# Altium schematic sheet Logic.SchDoc
size C; SheetNumber: 1; SheetTotal: 1
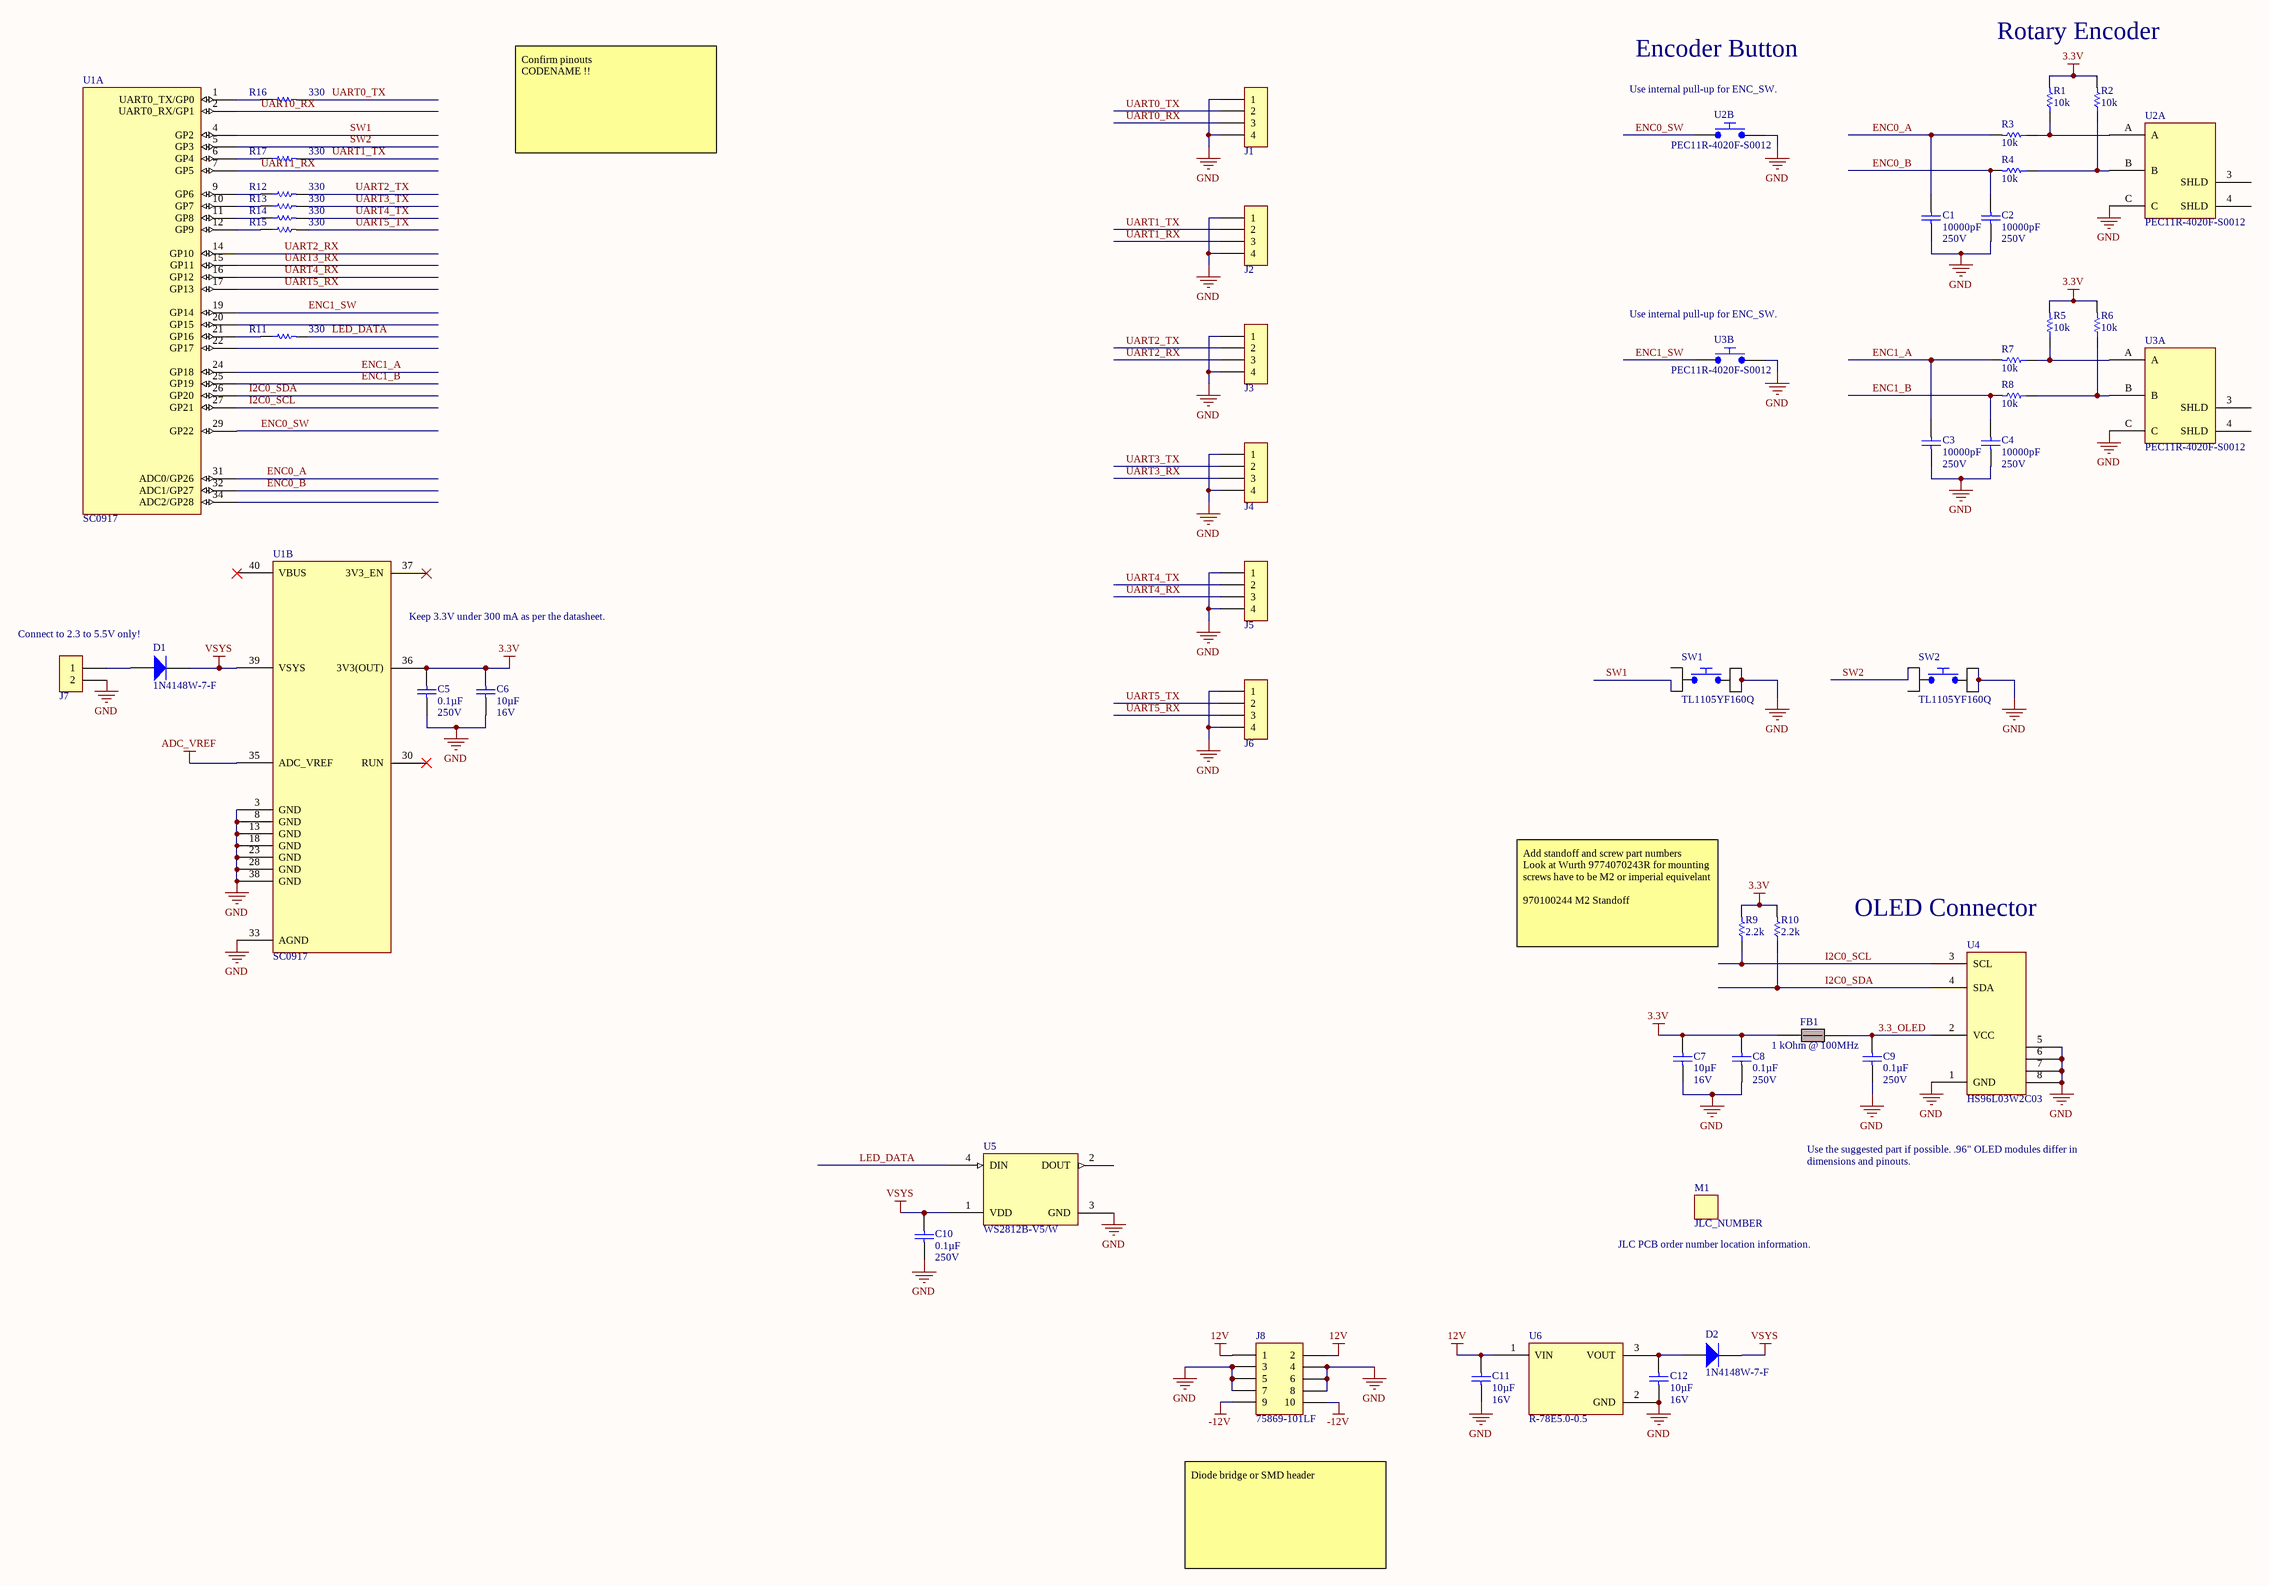
[diagram p0: Logic.SchDoc]

## Parts
C1  10000pF  Voltage: 250V  [Chip0805]
C2  10000pF  Voltage: 250V  [Chip0805]
C3  10000pF  Voltage: 250V  [Chip0805]
C4  10000pF  Voltage: 250V  [Chip0805]
C5  0.1µF  Voltage: 250V  [Chip0805]
C6  10µF  Voltage: 16V  [Chip0805]
C7  10µF  Voltage: 16V  [Chip0805]
C8  0.1µF  Voltage: 250V  [Chip0805]
C9  0.1µF  Voltage: 250V  [Chip0805]
C10  0.1µF  Voltage: 250V  [Chip0805]
C11  10µF  Voltage: 16V  [Chip0805]
C12  10µF  Voltage: 16V  [Chip0805]
D1  1N4148W-7-F  [SOD-123]
D2  1N4148W-7-F  [SOD-123]
FB1  Impedance @ Frequency: 1 kOhm @ 100MHz  [Chip0805]  (hidden comment: FERRITE)
J1  0533980471  [Molex_0533980471]  (value not drawn)
J2  0533980471  [Molex_0533980471]  (value not drawn)
J3  0533980471  [Molex_0533980471]  (value not drawn)
J4  0533980471  [Molex_0533980471]  (value not drawn)
J5  0533980471  [Molex_0533980471]  (value not drawn)
J6  0533980471  [Molex_0533980471]  (value not drawn)
J7  3-644456-2  [TE_3-644456-2]  (value not drawn)
J8  75869-101LF  [IDC_100_2x5]
M1  JLC_NUMBER  [JLC_NUMBER]  (no BOM)
R1  10k  [Chip0805]
R2  10k  [Chip0805]
R3  10k  [Chip0805]
R4  10k  [Chip0805]
R5  10k  [Chip0805]
R6  10k  [Chip0805]
R7  10k  [Chip0805]
R8  10k  [Chip0805]
R9  2.2k  [Chip0805]
R10  2.2k  [Chip0805]
R11  330  [Chip0805]
R12  330  [Chip0805]
R13  330  [Chip0805]
R14  330  [Chip0805]
R15  330  [Chip0805]
R16  330  [Chip0805]
R17  330  [Chip0805]
SW1  TL1105YF160Q  [E-Switch_TL1105YF]
SW2  TL1105YF160Q  [E-Switch_TL1105YF]
U1  SC0917  [RASPBERRY_PI_PICO_H]  (parts A,B of 2)
U2  PEC11R-4020F-S0012  [BOURNS_PEC11R-4020F-S]  (parts A,B of 2)
U3  PEC11R-4020F-S0012  [BOURNS_PEC11R-4020F-S]  (parts A,B of 2)
U4  HS96L03W2C03  [HS_HS96L03W2C03]
U5  WS2812B-V5/W  [WS2812B]
U6  R-78E5.0-0.5  [3-SIP_Module]

## Nets
3.3V: C5.2 C6.2 C7.2 C8.2 FB1.1 R1.2 R2.2 R5.2 R6.2 R9.2 R10.2 U1.36(3V3(OUT))
12V: C11.2 J8.1 J8.2 U6.1(VIN)
-12V: J8.9 J8.10
ADC_VREF: U1.35(ADC_VREF)
GND: C1.1 C2.1 C3.1 C4.1 C5.1 C6.1 C7.1 C8.1 C9.1 C10.1 C11.1 C12.1 J1.1 J1.4 J2.1 J2.4 J3.1 J3.4 J4.1 J4.4 J5.1 J5.4 J6.1 J6.4 J7.2 J8.3 J8.4 J8.5 J8.6 J8.7 J8.8 SW1.3 SW1.4 SW2.3 SW2.4 U1.3(GND) U1.8(GND) U1.13(GND) U1.18(GND) U1.23(GND) U1.28(GND) U1.33(AGND) U1.38(GND) U2.1 U2.C U3.1 U3.C U4.1(GND) U4.5 U4.6 U4.7 U4.8 U5.3(GND) U6.2(GND)
VSYS: C10.2 D1.1(C) D2.1(C) U1.39(VSYS) U5.1(VDD)
3.3_OLED: C9.2 FB1.2 U4.2(VCC)
ENC0_A: C1.2 R3.2 U1.31(ADC0/GP26)
ENC0_B: C2.2 R4.2 U1.32(ADC1/GP27)
ENC0_SW: U1.29(GP22) U2.2
ENC1_A: C3.2 R7.2 U1.24(GP18)
ENC1_B: C4.2 R8.2 U1.25(GP19)
ENC1_SW: U1.19(GP14) U3.2
I2C0_SCL: R9.1 U1.27(GP21) U4.3(SCL)
I2C0_SDA: R10.1 U1.26(GP20) U4.4(SDA)
LED_DATA: R11.2 U5.4(DIN)
SW1: SW1.2 U1.4(GP2)
SW2: SW2.1 U1.5(GP3)
UART0_RX: J1.3 U1.2(UART0_RX/GP1)
UART0_TX: J1.2 R16.2
UART1_RX: J2.3 U1.7(GP5)
UART1_TX: J2.2 R17.2
UART2_RX: J3.3 U1.14(GP10)
UART2_TX: J3.2 R12.2
UART3_RX: J4.3 U1.15(GP11)
UART3_TX: J4.2 R13.2
UART4_RX: J5.3 U1.16(GP12)
UART4_TX: J5.2 R14.2
UART5_RX: J6.3 U1.17(GP13)
UART5_TX: J6.2 R15.2
NetC12_2: C12.2 D2.2(A) U6.3(VOUT)
NetD1_2: D1.2(A) J7.1
NetR1_1: R1.1 R3.1 U2.A
NetR2_1: R2.1 R4.1 U2.B
NetR5_1: R5.1 R7.1 U3.A
NetR6_1: R6.1 R8.1 U3.B
NetR11_1: R11.1 U1.21(GP16)
NetR12_1: R12.1 U1.9(GP6)
NetR13_1: R13.1 U1.10(GP7)
NetR14_1: R14.1 U1.11(GP8)
NetR15_1: R15.1 U1.12(GP9)
NetR16_1: R16.1 U1.1(UART0_TX/GP0)
NetR17_1: R17.1 U1.6(GP4)

Not connected (* = marked no-connect by the designer): SW1 1; SW2 2; U1 20(GP15) 22(GP17) 30(RUN)* 34(ADC2/GP28) 37(3V3_EN)* 40(VBUS)*; U2 3(SHLD) 4(SHLD); U3 3(SHLD) 4(SHLD); U5 2(DOUT)

## Notes on the sheet
- Encoder Button
- Rotary Encoder
- (near U2) Use internal pull-up for ENC_SW.
- Confirm pinouts
  CODENAME !!
- (near U3) Use internal pull-up for ENC_SW.
- Connect to 2.3 to 5.5V only!
- (near U1) Keep 3.3V under 300 mA as per the datasheet.
- (near R9) Add standoff and screw part numbers
  Look at Wurth 9774070243R for mounting
  screws have to be M2 or imperial equivelant
  970100244 M2 Standoff
- (near U4) OLED Connector
- Use the suggested part if possible. .96" OLED modules differ in dimensions and pinouts.
- (near M1) JLC PCB order number location information.
- Diode bridge or SMD header
- Title:
- This work is licensed under a Creative Commons Attribution 4.0 International License. Derivative works should remove all Sophistry branding and ‘é’ watermark.
- Date:
- Engineer:
- Revision:
- Codename:
- Time:
- Variant:
- Sheet
- of

## Library data of the parts
C1-C4 = C2012X7R2E103M125AE: CAP CER 10000PF 250V X7R 0805; Manufacturer: TDK Corporation; Tolerance: ±20%; PartNumber: C2012X7R2E103M125AE; HelpURL: http://product.tdk.com/capacitor/mlcc/en/documents/mlcc_commercial_soft_en.pdf; Supplier 1: Digi-Key; Supplier Part Number 1: 445-6805-1-ND; Supplier 2: Mouser; Manufacturer Part Number: C2012X7R2E103M125AE; Series: C; Capacitance: 10000pF; Temperature Coefficient: X7R; Mounting Type: Surface Mount, MLCC; Operating Temperature: -55°C ~ 125°C; Applications: Boardflex Sensitive; Ratings: -; Package / Case: 0805 (2012 Metric); Size / Dimension: 0.079" L x 0.049" W (2.00mm x 1.25mm); Height - Seated (Max): -; Thickness (Max): 0.057" (1.45mm); Lead Spacing: -; Features: Soft Termination; Lead Style: -
C5 C8-C10 = C2012X7T2E104K125AA: CAP CER 0.1UF 250V 10% X7T 0805; Manufacturer: TDK Corporation; PartNumber: C2012X7T2E104K125AA; HelpURL: http://product.tdk.com/capacitor/mlcc/en/documents/mlcc_commercial_midvoltage_en.pdf; Supplier 1: Digi-Key; Supplier Part Number 1: 445-7749-1-ND; Supplier 2: Mouser; Manufacturer Part Number: C2012X7T2E104K125AA; Series: C; Capacitance: 0.1µF; Tolerance: ±10%; Temperature Coefficient: X7T; Mounting Type: Surface Mount, MLCC; Operating Temperature: -55°C ~ 125°C; Applications: General Purpose; Ratings: -; Package / Case: 0805 (2012 Metric); Size / Dimension: 0.079" L x 0.049" W (2.00mm x 1.25mm); Height - Seated (Max): -; Thickness (Max): 0.057" (1.45mm); Lead Spacing: -; Features: -; Lead Style: -
C6 C7 C11 C12 = C2012X5R1C106K125AC: CAP CER 10UF 16V 10% X5R 0805; Manufacturer: TDK Corporation; PartNumber: C2012X5R1C106K125AC; HelpURL: http://product.tdk.com/capacitor/mlcc/en/documents/mlcc_commercial_general_en.pdf; Supplier 1: Digi-Key; Supplier Part Number 1: 445-7646-1-ND; Supplier 2: Mouser; Manufacturer Part Number: C2012X5R1C106K125AC; Series: C; Capacitance: 10µF; Tolerance: ±10%; Temperature Coefficient: X5R; Mounting Type: Surface Mount, MLCC; Operating Temperature: -55°C ~ 85°C; Applications: General Purpose; Ratings: -; Package / Case: 0805 (2012 Metric); Size / Dimension: 0.079" L x 0.049" W (2.00mm x 1.25mm); Height - Seated (Max): -; Thickness (Max): 0.057" (1.45mm); Lead Spacing: -; Features: -; Lead Style: -
D1 D2 = 1N4148W-7-F: DIODE SWITCH 100V 0.15A SOD123; Manufacturer: Diodes Incorporated; Diode Type: Standard; Current - Average Rectified (Io): 150mA; Voltage - Forward (Vf) (Max) @ If: 1.25V @ 150mA; Speed: Small Signal =< 200mA (Io), Any Speed; Reverse Recovery Time (trr): 4ns; Current - Reverse Leakage @ Vr: 1µA @ 75V; Capacitance @ Vr, F: 2pF @ 0V, 1MHz; PartNumber: 1N4148W-7-F; Datasheets: http://www.diodes.com/datasheets/ds30086.pdf; Supplier 1: Digi-Key; Supplier Part Number 1: 1N4148W-FDICT-ND; Manufacturer Part Number: 1N4148W-7-F; Series: 0; Voltage - DC Reverse (Vr) (Max): 100V; Mounting Type: Surface Mount; Package / Case: SOD-123; Supplier Device Package: SOD-123; Operating Temperature - Junction: -65°C ~ 150°C
FB1 = 74279205: FERRITE BEAD 1000 OHM .20A 0805; Manufacturer: Wurth Electronics Inc; Current Rating: 200mA; DC Resistance (DCR): 450 mOhm Max; Filter Type: Differential Mode - Single; PartNumber: 74279205; HelpURL: http://katalog.we-online.de/pbs/datasheet/74279205.pdf; Supplier 1: Digi-Key; Supplier Part Number 1: 732-1606-1-ND; Manufacturer Part Number: 74279205; Series: WE-CBF; Package / Case: 0805 (2012 Metric); Mounting Type: Surface Mount; Height (Max): 0.043" (1.10mm); Size / Dimension: 0.079" L x 0.047" W (2.00mm x 1.20mm)
J1-J6 = 0533980471: CONN HEADER SMD 4POS 1.25MM; Manufacturer: Molex; PartNumber: 0533980471; Supplier 1: Digi-Key; Supplier 2: Mouser; Supplier 21: LCSC; Supplier Part Number 1: WM7608CT-ND; Supplier Part Number 2: 538-53398-0471; Supplier Part Number 3: C234195; HelpURL: https://www.molex.com/pdm_docs/sd/533980471_sd.pdf; Manufacturer Part Number: 0533980471
J7 = 3-644456-2: CONN HEADER VERT 2POS .100 TIN; Manufacturer: TE Connectivity; PartNumber: 3-644456-2; Supplier 1: Digi-Key; Supplier 2: Mouser; Supplier Part Number 1: A31112-ND; Supplier Part Number 2: 571-3-644456-2; HelpURL: http://www.te.com/commerce/DocumentDelivery/DDEController?Action=srchrtrv&DocNm=644456&DocType=Customer+Drawing&DocLang=English; Manufacturer Part Number: 3-644456-2
J8 = 75869-101LF: CONN HEADER 10POS DUAL VERT PCB; Manufacturer: FCI; PartNumber: 75869-101LF; Supplier 1: Digi-Key; Supplier 2: Mouser; Supplier Part Number 2: 649-75869-101LF; HelpURL: http://portal.fciconnect.com/Comergent//fci/drawing/75869.pdf; Supplier Part Number 1: 609-1774-ND; Manufacturer Part Number: 75869-101LF
M1 = JLC_NUMBER: JLC Order Number Location; PartNumber: JLC_NUMBER; Manufacturer Part Number: JLC_NUMBER
R1-R8 = CRCW080510K0FKEA: RES 10.0K OHM 1/8W 1% 0805 SMD; Manufacturer: Vishay Dale; Power (Watts): 0.125W, 1/8W; Temperature Coefficient: ±100ppm/°C; PartNumber: CRCW080510K0FKEA; HelpURL: http://www.vishay.com/doc?20035; Supplier 1: Digi-Key; Supplier Part Number 1: 541-10.0KCCT-ND; Supplier 2: Mouser; Manufacturer Part Number: CRCW080510K0FKEA; Series: CRCW; Resistance: 10k; Tolerance: ±1%; Composition: Thick Film; Features: Automotive AEC-Q200 Qualified; Package / Case: 0805 (2012 Metric); Supplier Device Package: 0805 (2012 Metric); Size / Dimension: 0.079" L x 0.049" W (2.00mm x 1.25mm); Height: 0.020" (0.50mm); Number of Terminations: 2
R9 R10 = CRCW08052K20FKEA: RES 2.20K OHM 1/8W 1% 0805 SMD; Manufacturer: Vishay Dale; Power (Watts): 0.125W, 1/8W; Temperature Coefficient: ±100ppm/°C; PartNumber: CRCW08052K20FKEA; HelpURL: http://www.vishay.com/doc?20035; Supplier 1: Digi-Key; Supplier Part Number 1: 541-2.20KCCT-ND; Supplier 2: Mouser; Manufacturer Part Number: CRCW08052K20FKEA; Series: CRCW; Resistance: 2.2k; Tolerance: ±1%; Composition: Thick Film; Features: Automotive AEC-Q200 Qualified; Package / Case: 0805 (2012 Metric); Supplier Device Package: 0805 (2012 Metric); Size / Dimension: 0.079" L x 0.049" W (2.00mm x 1.25mm); Height: 0.020" (0.50mm); Number of Terminations: 2
R11-R17 = CRCW0805330RFKEA: RES 330 OHM 1/8W 1% 0805 SMD; Manufacturer: Vishay Dale; Power (Watts): 0.125W, 1/8W; Temperature Coefficient: ±100ppm/°C; PartNumber: CRCW0805330RFKEA; HelpURL: http://www.vishay.com/doc?20035; Supplier 1: Digi-Key; Supplier Part Number 1: 541-330CCT-ND; Supplier 2: Mouser; Manufacturer Part Number: CRCW0805330RFKEA; Series: CRCW; Resistance: 330; Tolerance: ±1%; Composition: Thick Film; Features: Automotive AEC-Q200 Qualified; Package / Case: 0805 (2012 Metric); Supplier Device Package: 0805 (2012 Metric); Size / Dimension: 0.079" L x 0.049" W (2.00mm x 1.25mm); Height: 0.020" (0.50mm); Number of Terminations: 2
SW1 SW2 = TL1105YF160Q: SWITCH TACTILE SPST-NO 0.05A 12V; Manufacturer: E-Switch; PartNumber: TL1105YF160Q; HelpURL: https://configured-product-images.s3.amazonaws.com/Datasheets/TL1105.pdf; Supplier 1: Digi-Key; Supplier 2: Mouser; Supplier 3: LCSC; Supplier Part Number 1: EG5455-ND; Supplier Part Number 2: 612-TL1105YF160Q; Supplier Part Number 3: C4364602; Manufacturer Part Number: TL1105YF160Q
U1 = SC0917: RASPBERRY PI PICO H; PartNumber: SC0917; Supplier 1: Digi-Key; Supplier Part Number 1: 2648-SC0917-ND; Manufacturer Part Number: SC0917; Manufacturer: Raspberry Pi
U2 U3 = PEC11R-4020F-S0012: ROTARY ENCODER MECHANICAL 12PPR; Manufacturer: Bourns Inc.; PartNumber: PEC11R-4020F-S0012; Datasheets: https://www.bourns.com/docs/Product-Datasheets/PEC11R.pdf; Supplier 1: Digi-Key; Supplier 2: Mouser; Supplier Part Number 1: PEC11R-4020F-S0012-ND; Supplier Part Number 2: 652-PEC11R-4020F-S12; Manufacturer Part Number: PEC11R-4020F-S0012
U4 = HS96L03W2C03: 0.96" I2C OLED MODULE; Manufacturer: HS; PartNumber: HS96L03W2C03; Supplier 3: LCSC; Supplier Part Number 3: C5248080; Manufacturer Part Number: HS96L03W2C03
U5 = WS2812B-V5/W: Addressable RGB LED; Manufacturer: Worldsemi; PartNumber: WS2812B-V5/W; Datasheets: https://www.peace-corp.co.jp/data/WS2812B-V5_V1.0_EN.pdf; Supplier 1: Digi-Key; Supplier Part Number 1: 1568-COM-16347CT-ND; Supplier 2: Mouser; Supplier Part Number 2: 474-COM-24837; Supplier 3: LCSC; Supplier Part Number 3: C2874885; Manufacturer Part Number: WS2812B-V5/W
U6 = R-78E5.0-0.5: DC DC CONVERTER 5V 3W; Manufacturer: Recom Power; PartNumber: R-78E5.0-0.5; HelpURL: https://recom-power.com/pdf/Innoline/R-78E-0.5.pdf; Supplier 1: Digi-Key; Supplier Part Number 1: 945-1648-5-ND; Supplier 2: Mouser; Supplier Part Number 2: 919-R-78E5.0-0.5; Supplier 3: LCSC; Supplier Part Number 21: C5199916; Manufacturer Part Number: R-78E5.0-0.5